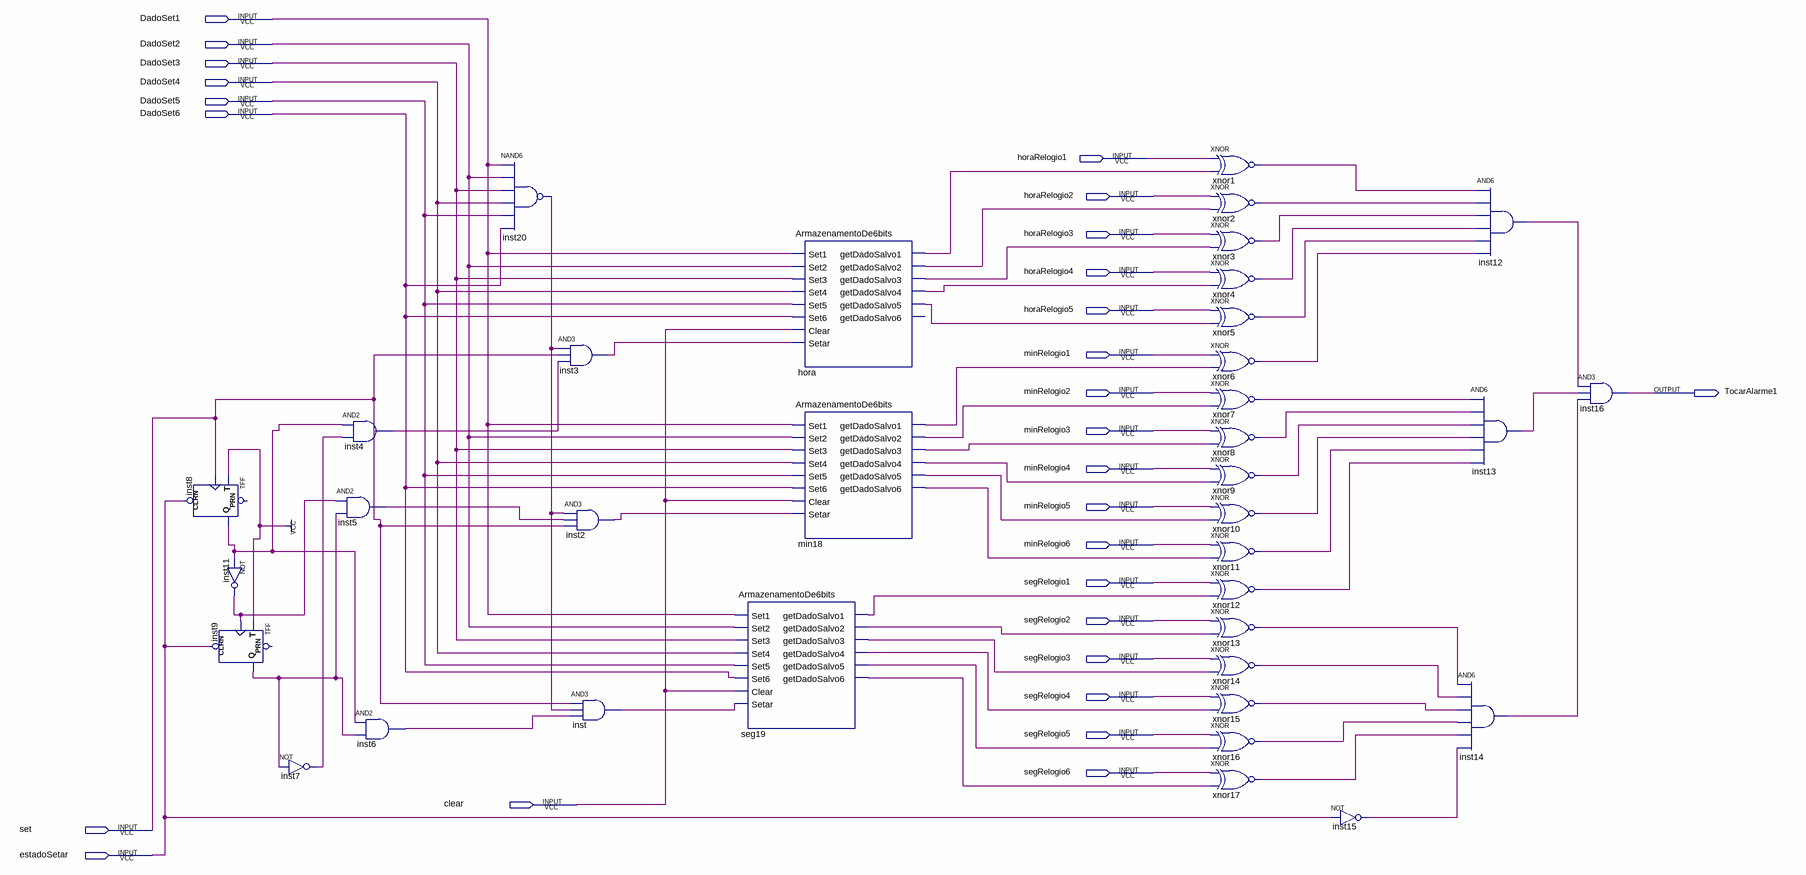
[diagram p0: schematic sheet]
// Quartus schematic Alarme.bdf as structural Verilog: 36 symbols, 27 pins
module Alarme (
  input  DadoSet1,
  input  DadoSet2,
  input  DadoSet3,
  input  DadoSet4,
  input  DadoSet5,
  input  DadoSet6,
  input  horaRelogio1,
  input  horaRelogio2,
  input  horaRelogio3,
  input  horaRelogio4,
  input  horaRelogio5,
  input  minRelogio1,
  input  minRelogio2,
  input  minRelogio3,
  input  minRelogio4,
  input  minRelogio5,
  input  minRelogio6,
  input  segRelogio1,
  input  segRelogio2,
  input  segRelogio3,
  input  segRelogio4,
  input  segRelogio5,
  input  segRelogio6,
  input  clear,
  input  set,
  input  estadoSetar,
  output TocarAlarme1
);

  wire hora_getdadosalvo1, hora_getdadosalvo2, hora_getdadosalvo3, hora_getdadosalvo4, hora_getdadosalvo5,
       inst2_out, inst3_out, inst4_out, inst5_out, inst6_out, inst7_out, inst8_q, inst9_q, inst11_out,
       inst12_out, inst13_out, inst14_out, inst15_out, inst20_out, inst_out, min18_getdadosalvo1,
       min18_getdadosalvo2, min18_getdadosalvo3, min18_getdadosalvo4, min18_getdadosalvo5,
       min18_getdadosalvo6, seg19_getdadosalvo1, seg19_getdadosalvo2, seg19_getdadosalvo3,
       seg19_getdadosalvo4, seg19_getdadosalvo5, seg19_getdadosalvo6, xnor1_out, xnor2_out, xnor3_out,
       xnor4_out, xnor5_out, xnor6_out, xnor7_out, xnor8_out, xnor9_out, xnor10_out, xnor11_out, xnor12_out,
       xnor13_out, xnor14_out, xnor15_out, xnor16_out, xnor17_out;

  TFF inst8 (.CLRN(estadoSetar), .T(1'b1), .CLK(set), .Q(inst8_q));  // open: PRN
  not inst11 (inst11_out, inst8_q);
  TFF inst9 (.CLRN(estadoSetar), .T(1'b1), .CLK(inst11_out), .Q(inst9_q));  // open: PRN
  not inst7 (inst7_out, inst9_q);
  and inst4 (inst4_out, inst8_q, inst7_out);
  and inst5 (inst5_out, inst11_out, inst9_q);
  and inst6 (inst6_out, inst8_q, inst9_q);
  nand inst20 (inst20_out, DadoSet1, DadoSet2, DadoSet3, DadoSet4, DadoSet5, DadoSet6);
  and inst3 (inst3_out, inst20_out, set, inst4_out);
  and inst2 (inst2_out, inst20_out, inst5_out, set);
  and inst (inst_out, set, inst20_out, inst6_out);
  ArmazenamentoDe6bits seg19 (
    .Set1(DadoSet1), .Set2(DadoSet2), .Set3(DadoSet3), .Set4(DadoSet4), .Set5(DadoSet5), .Set6(DadoSet6),
    .Clear(clear), .Setar(inst_out), .getDadoSalvo1(seg19_getdadosalvo1),
    .getDadoSalvo2(seg19_getdadosalvo2), .getDadoSalvo3(seg19_getdadosalvo3),
    .getDadoSalvo4(seg19_getdadosalvo4), .getDadoSalvo5(seg19_getdadosalvo5),
    .getDadoSalvo6(seg19_getdadosalvo6));
  ArmazenamentoDe6bits hora (
    .Set1(DadoSet1), .Set2(DadoSet2), .Set3(DadoSet3), .Set4(DadoSet4), .Set5(DadoSet5), .Set6(DadoSet6),
    .Clear(clear), .Setar(inst3_out), .getDadoSalvo1(hora_getdadosalvo1), .getDadoSalvo2(hora_getdadosalvo2),
    .getDadoSalvo3(hora_getdadosalvo3), .getDadoSalvo4(hora_getdadosalvo4), .getDadoSalvo5(hora_getdadosalvo5));  // open: getDadoSalvo6
  ArmazenamentoDe6bits min18 (
    .Set1(DadoSet1), .Set2(DadoSet2), .Set3(DadoSet3), .Set4(DadoSet4), .Set5(DadoSet5), .Set6(DadoSet6),
    .Clear(clear), .Setar(inst2_out), .getDadoSalvo1(min18_getdadosalvo1),
    .getDadoSalvo2(min18_getdadosalvo2), .getDadoSalvo3(min18_getdadosalvo3),
    .getDadoSalvo4(min18_getdadosalvo4), .getDadoSalvo5(min18_getdadosalvo5),
    .getDadoSalvo6(min18_getdadosalvo6));
  xnor xnor1 (xnor1_out, horaRelogio1, hora_getdadosalvo1);
  xnor xnor2 (xnor2_out, horaRelogio2, hora_getdadosalvo2);
  xnor xnor3 (xnor3_out, horaRelogio3, hora_getdadosalvo3);
  xnor xnor4 (xnor4_out, horaRelogio4, hora_getdadosalvo4);
  xnor xnor5 (xnor5_out, horaRelogio5, hora_getdadosalvo5);
  xnor xnor6 (xnor6_out, minRelogio1, min18_getdadosalvo1);
  xnor xnor7 (xnor7_out, minRelogio2, min18_getdadosalvo2);
  xnor xnor8 (xnor8_out, minRelogio3, min18_getdadosalvo3);
  xnor xnor9 (xnor9_out, minRelogio4, min18_getdadosalvo4);
  xnor xnor10 (xnor10_out, minRelogio5, min18_getdadosalvo5);
  xnor xnor11 (xnor11_out, minRelogio6, min18_getdadosalvo6);
  xnor xnor12 (xnor12_out, segRelogio1, seg19_getdadosalvo1);
  xnor xnor13 (xnor13_out, segRelogio2, seg19_getdadosalvo2);
  xnor xnor14 (xnor14_out, segRelogio3, seg19_getdadosalvo3);
  xnor xnor15 (xnor15_out, segRelogio4, seg19_getdadosalvo4);
  xnor xnor16 (xnor16_out, segRelogio5, seg19_getdadosalvo5);
  xnor xnor17 (xnor17_out, segRelogio6, seg19_getdadosalvo6);
  not inst15 (inst15_out, estadoSetar);
  and inst13 (inst13_out, xnor7_out, xnor8_out, xnor9_out, xnor10_out, xnor11_out, xnor12_out);
  and inst14 (inst14_out, xnor13_out, xnor14_out, xnor15_out, xnor16_out, xnor17_out, inst15_out);
  and inst12 (inst12_out, xnor1_out, xnor2_out, xnor3_out, xnor4_out, xnor5_out, xnor6_out);
  and inst16 (TocarAlarme1, inst12_out, inst13_out, inst14_out);
endmodule
